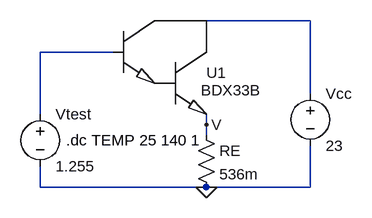
[diagram p0: schematic term-runaway-test.asc]
term-runaway-test.asc, the LTspice schematic file:
Version 4
SHEET 1 1032 680
WIRE 32 16 -128 16
WIRE -272 64 -384 64
WIRE 32 128 32 16
WIRE -384 160 -384 64
WIRE -128 176 -128 160
WIRE -128 192 -128 176
WIRE -384 272 -384 240
WIRE -128 272 -384 272
WIRE 32 272 32 208
WIRE 32 272 -128 272
FLAG -128 272 0
FLAG -128 176 V
SYMBOL voltage 32 112 R0
WINDOW 123 0 0 Left 0
WINDOW 39 0 0 Left 0
SYMATTR InstName Vcc
SYMATTR Value 23
SYMBOL myLib\\BDX33B -256 16 R0
SYMATTR InstName U1
SYMBOL res -144 176 R0
SYMATTR InstName RE
SYMATTR Value 536m
SYMBOL voltage -384 144 R0
WINDOW 123 0 0 Left 0
WINDOW 39 0 0 Left 0
SYMATTR InstName Vtest
SYMATTR Value 1.255
TEXT -344 200 Left 0 !.dc TEMP 25 140 1

The netlist it stands for:
* term-runaway-test.asc
Vcc N001 0 23
XU1 N001 N002 V BDX33B  ; pins C B E
RE V 0 536m
Vtest N002 0 1.255
.dc TEMP 25 140 1
.lib myLib\BDX33B.lib
.backanno
.end